# Altium project Tray2.PrjPcb
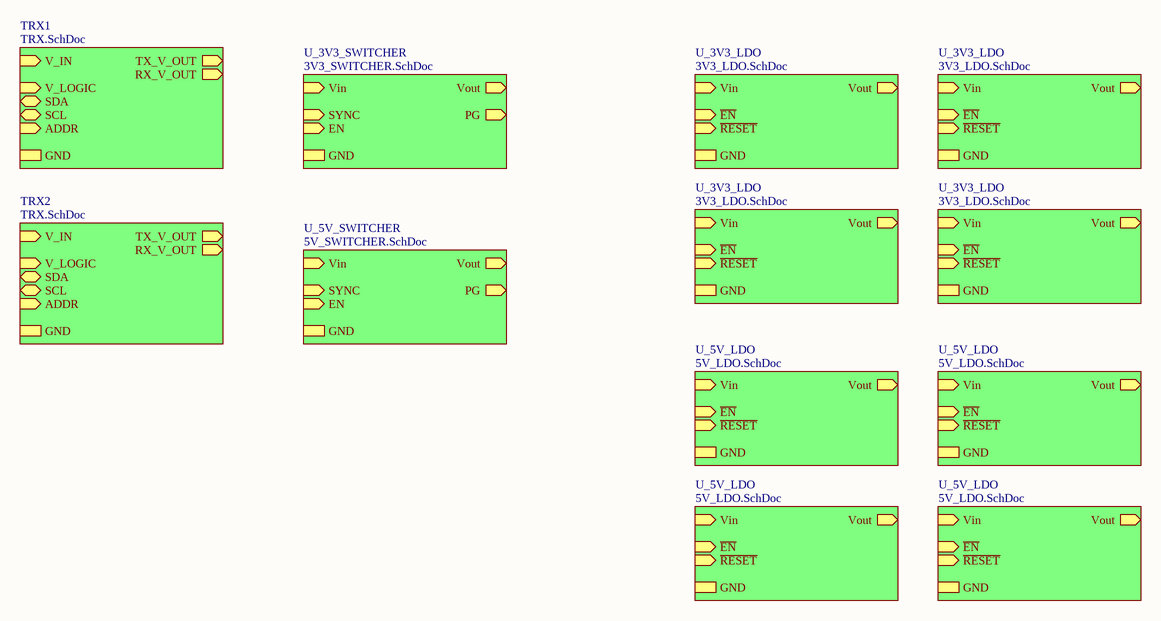
[diagram p0: POWER.SchDoc]
6 sheets, 196 parts. Net scope: hierarchical (ports join the sheet entries above them; power ports are global).
Sheets:
  POWER.SchDoc
    TRX1 = TRX.SchDoc
    TRX2 = TRX.SchDoc
    U_3V3_SWITCHER = 3V3_SWITCHER.SchDoc
    U_5V_SWITCHER = 5V_SWITCHER.SchDoc
    U_3V3_LDO = 3V3_LDO.SchDoc
    U_3V3_LDO = 3V3_LDO.SchDoc
    U_3V3_LDO = 3V3_LDO.SchDoc
    U_3V3_LDO = 3V3_LDO.SchDoc
    U_5V_LDO = 5V_LDO.SchDoc
    U_5V_LDO = 5V_LDO.SchDoc
    U_5V_LDO = 5V_LDO.SchDoc
    U_5V_LDO = 5V_LDO.SchDoc

## Sheet POWER.SchDoc
size A4

### Sub-sheets
TRX1 = TRX.SchDoc: V_IN (in), TX_V_OUT (out), RX_V_OUT (out), V_LOGIC (in), SCL (bidir), SDA (bidir), GND, ADDR (in)
TRX2 = TRX.SchDoc: V_IN (in), TX_V_OUT (out), RX_V_OUT (out), V_LOGIC (in), SCL (bidir), SDA (bidir), GND, ADDR (in)
U_3V3_LDO = 3V3_LDO.SchDoc: Vout (out), ~{EN} (in), ~{RESET} (in), Vin (in), GND
U_3V3_LDO = 3V3_LDO.SchDoc: Vout (out), ~{EN} (in), ~{RESET} (in), Vin (in), GND
U_3V3_LDO = 3V3_LDO.SchDoc: Vout (out), ~{EN} (in), ~{RESET} (in), Vin (in), GND
U_3V3_LDO = 3V3_LDO.SchDoc: Vout (out), ~{EN} (in), ~{RESET} (in), Vin (in), GND
U_3V3_SWITCHER = 3V3_SWITCHER.SchDoc: PG (out), Vout (out), EN (in), Vin (in), SYNC (in), GND
U_5V_LDO = 5V_LDO.SchDoc: Vout (out), ~{EN} (in), ~{RESET} (in), Vin (in), GND
U_5V_LDO = 5V_LDO.SchDoc: Vout (out), ~{EN} (in), ~{RESET} (in), Vin (in), GND
U_5V_LDO = 5V_LDO.SchDoc: Vout (out), ~{EN} (in), ~{RESET} (in), Vin (in), GND
U_5V_LDO = 5V_LDO.SchDoc: Vout (out), ~{EN} (in), ~{RESET} (in), Vin (in), GND
U_5V_SWITCHER = 5V_SWITCHER.SchDoc: PG (out), Vout (out), EN (in), Vin (in), SYNC (in), GND

### Nets
GND: sheet TRX1/GND, sheet TRX2/GND
VCC: sheet TRX1/V_LOGIC, sheet TRX2/V_LOGIC

## Sheet TRX.SchDoc: Title Block Template
size A3; Engineer: C. BROWN; Organization: BLUEsat Project; Address1: Room 419; Address2: School of EE&T; Address3: UNSW, NSW 2052; Address4: Australia; DocumentNumber: TITL0002; SheetNumber: 1; SheetTotal: 1; Description: Sample Title Block; Version: 2.0
Used 2 times, as channels TRX1, TRX2. Parts and nets are listed once, with the designators drawn on the sheet.
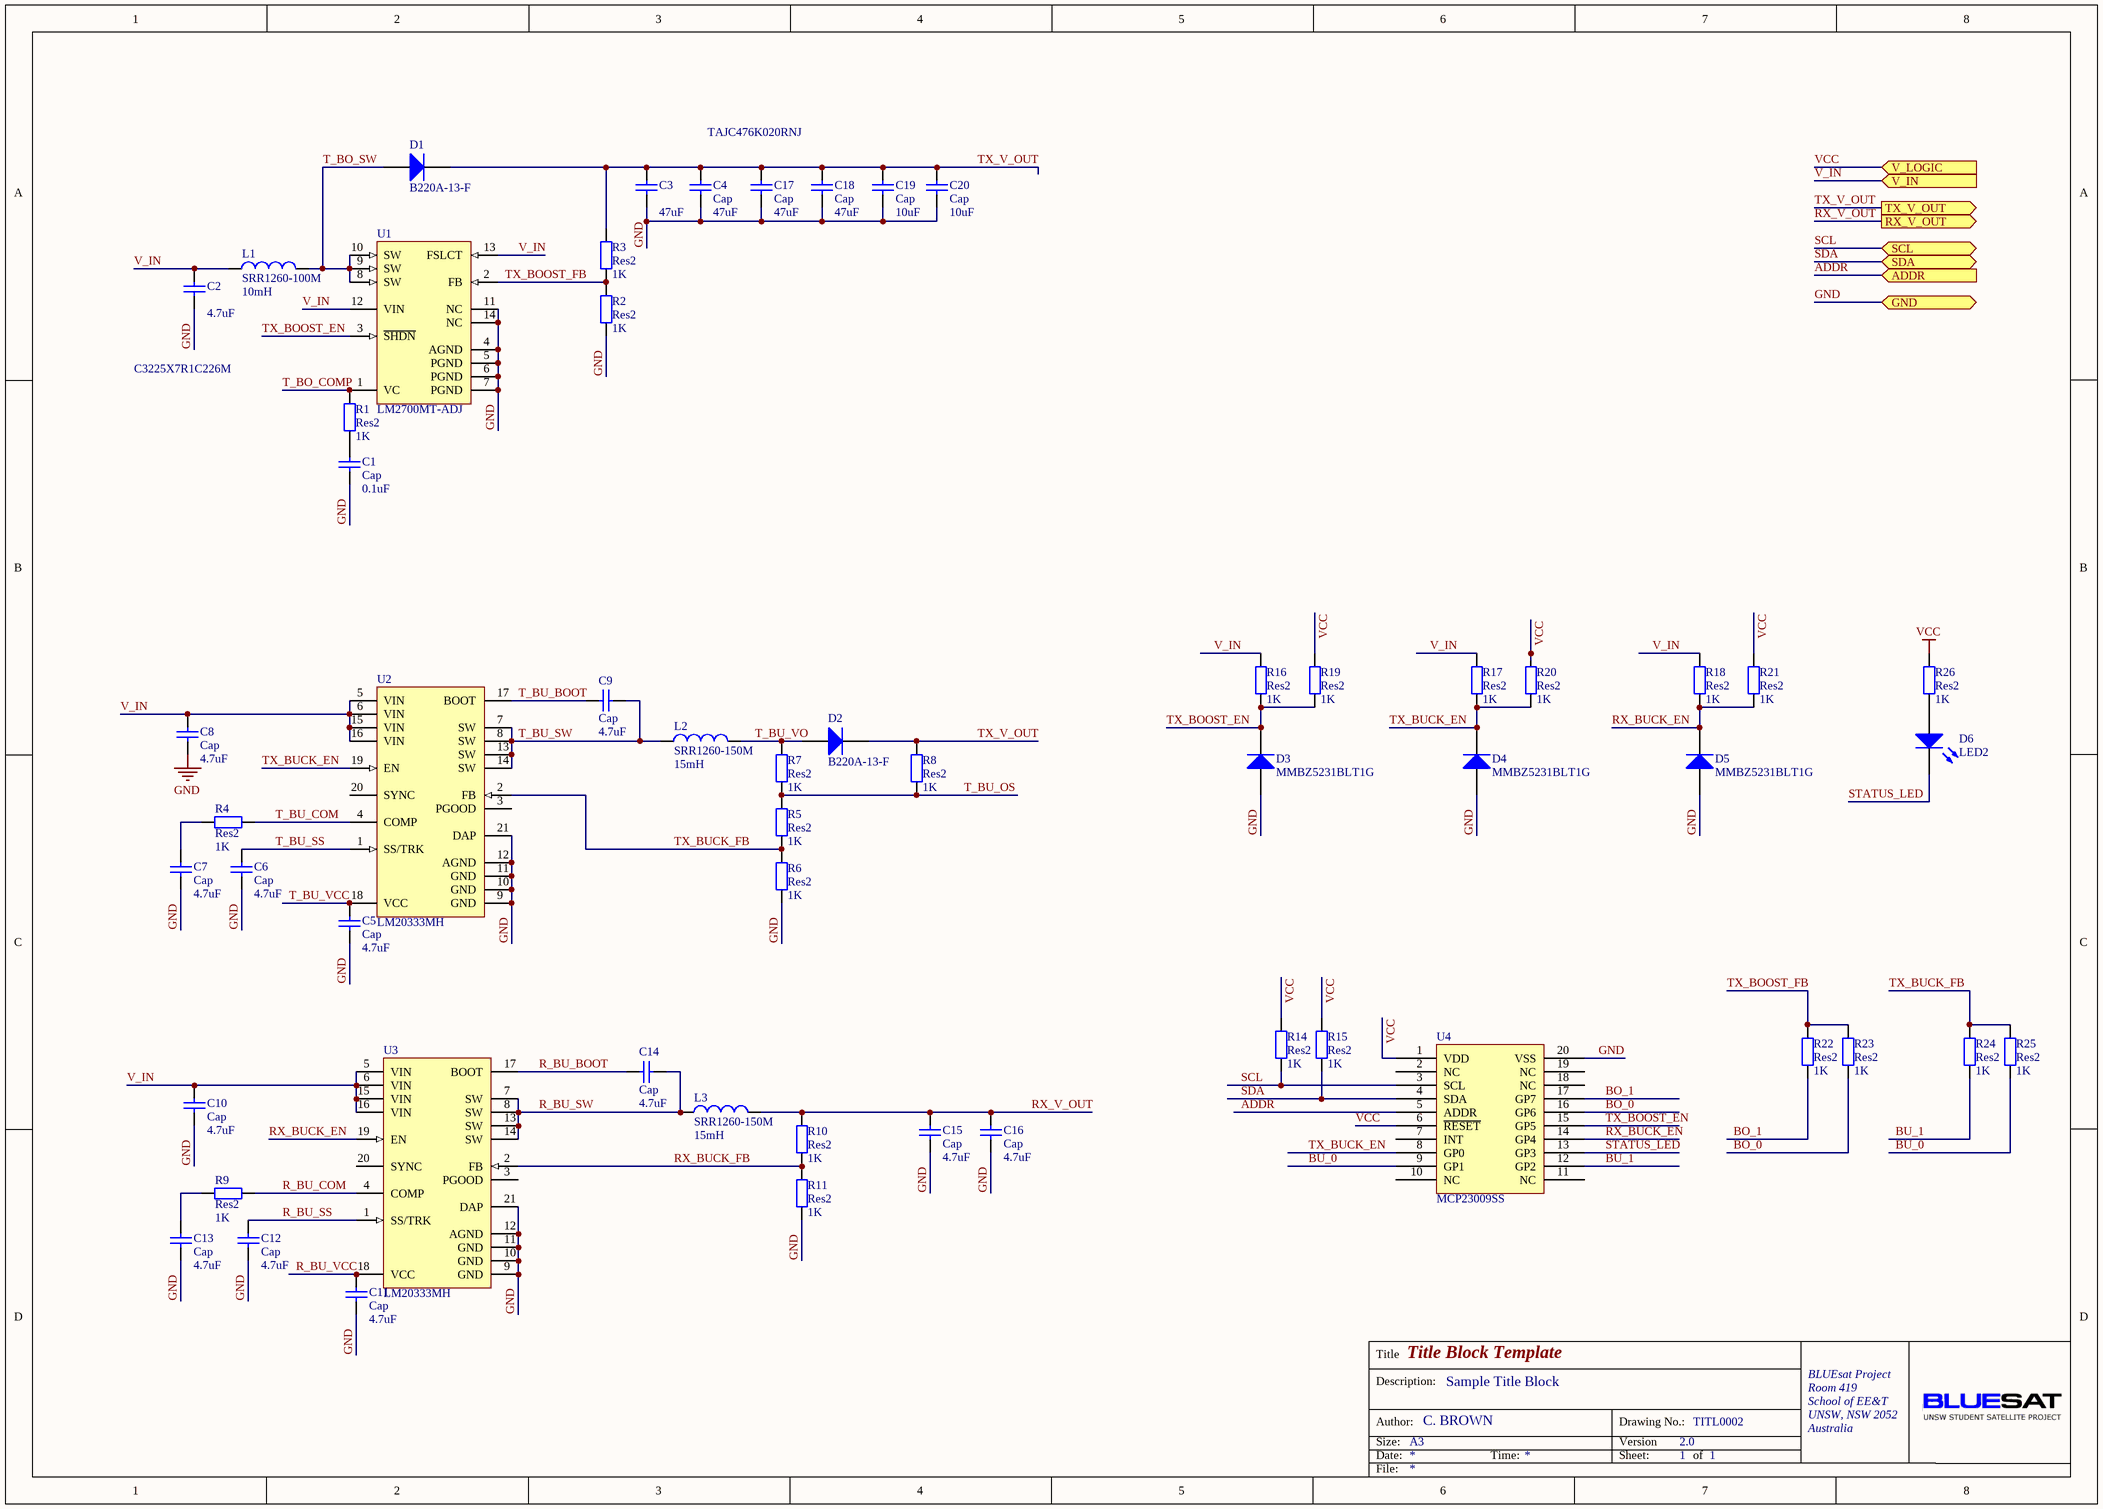
[diagram p1: TRX.SchDoc]

### Parts
C1  Cap  value 0.1uF  [R0805M]
C2  C3225X7R1C226M  value 4.7uF  [R1210M]
C3  TAJC476K020RNJ  value 47uF  [TANTCASEC]
C4  Cap  value 47uF  [TANTCASEC]
C5  Cap  value 4.7uF  [R0805M]
C6  Cap  value 4.7uF  [R0805M]
C7  Cap  value 4.7uF  [R0805M]
C8  Cap  value 4.7uF  [R1210M]
C9  Cap  value 4.7uF  [R0805M]
C10  Cap  value 4.7uF  [R1210M]
C11  Cap  value 4.7uF  [R0805M]
C12  Cap  value 4.7uF  [R0805M]
C13  Cap  value 4.7uF  [R0805M]
C14  Cap  value 4.7uF  [R0805M]
C15  Cap  value 4.7uF  [R0805M]
C16  Cap  value 4.7uF  [R0805M]
C17  Cap  value 47uF  [TANTCASEC]
C18  Cap  value 47uF  [TANTCASEC]
C19  Cap  value 10uF  [R0805M]
C20  Cap  value 10uF  [R0805M]
D1  B220A-13-F  [DIODESMA]
D2  B220A-13-F  [DIODESMA]
D3  MMBZ5231BLT1G  [SOT95P240-3N]
D4  MMBZ5231BLT1G  [SOT95P240-3N]
D5  MMBZ5231BLT1G  [SOT95P240-3N]
D6  LED2  [R0805M]
L1  SRR1260-100M  value 10mH  [SRR1260M]
L2  SRR1260-150M  value 15mH  [SRR1260M]
L3  SRR1260-150M  value 15mH  [SRR1260M]
R1  Res2  value 1K  [R0805M]
R2  Res2  value 1K  [R0805M]
R3  Res2  value 1K  [R0805M]
R4  Res2  value 1K  [R0805M]
R5  Res2  value 1K  [R0805M]
R6  Res2  value 1K  [R0805M]
R7  Res2  value 1K  [R0805M]
R8  Res2  value 1K  [R0805M]
R9  Res2  value 1K  [R0805M]
R10  Res2  value 1K  [R0805M]
R11  Res2  value 1K  [R0805M]
R14  Res2  value 1K  [R0805M]
R15  Res2  value 1K  [R0805M]
R16  Res2  value 1K  [R0805M]
R17  Res2  value 1K  [R0805M]
R18  Res2  value 1K  [R0805M]
R19  Res2  value 1K  [R0805M]
R20  Res2  value 1K  [R0805M]
R21  Res2  value 1K  [R0805M]
R22  Res2  value 1K  [R0805M]
R23  Res2  value 1K  [R0805M]
R24  Res2  value 1K  [R0805M]
R25  Res2  value 1K  [R0805M]
R26  Res2  value 1K  [R0805M]
U1  LM2700MT-ADJ  [MTC14_N]
U2  LM20333MH  [MXA20A_N]
U3  LM20333MH  [MXA20A_N]
U4  MCP23009SS  [SSOP-SS20_M]

### Ports
ADDR (in), GND, RX_V_OUT (out), SCL (bidir), SDA (bidir), TX_V_OUT (out), V_IN (in), V_LOGIC (in)

### Nets
GND: C1.1 C2.1 C3.1 C4.1 C5.1 C6.1 C7.1 C8.1 C10.1 C11.1 C12.1 C13.1 C15.1 C16.1 C17.1 C18.1 C19.1 C20.1 D3.1(A) D4.1(A) D5.1(A) R2.1 R6.2 R11.1 U1.4(AGND) U1.5(PGND) U1.6(PGND) U1.7(PGND) U1.11(NC) U1.14(NC) U2.9(GND) U2.10(GND) U2.11(GND) U2.12(AGND) U2.21(DAP) U3.9(GND) U3.10(GND) U3.11(GND) U3.12(AGND) U3.21(DAP) U4.20(VSS) ; port GND
VCC: R14.2 R15.2 R19.2 R20.2 R21.2 R26.2 U4.1(VDD) U4.6(~{RESET}) ; port V_LOGIC
ADDR: U4.5(ADDR) ; port ADDR
BO_0: R23.1 U4.16(GP6)
BO_1: R22.1 U4.17(GP7)
BU_0: R25.1 U4.9(GP1)
BU_1: R24.1 U4.12(GP2)
R_BU_BOOT: C14.1 U3.17(BOOT)
R_BU_COM: R9.1 U3.4(COMP)
R_BU_SS: C12.2 U3.1(SS/TRK)
R_BU_SW: C14.2 L3.1 U3.7(SW) U3.8(SW) U3.13(SW) U3.14(SW)
R_BU_VCC: C11.2 U3.18(VCC)
RX_BUCK_EN: D5.3(K) R18.1 R21.1 U3.19(EN) U4.14(GP4)
RX_BUCK_FB: R10.1 R11.2 U3.2(FB)
RX_V_OUT: C15.2 C16.2 L3.2 R10.2 ; port RX_V_OUT
SCL: R14.1 U4.3(SCL) ; port SCL
SDA: R15.1 U4.4(SDA) ; port SDA
STATUS_LED: D6.2(K) U4.13(GP3)
T_BO_COMP: R1.2 U1.1(VC)
T_BO_SW: D1.1(A) L1.2 U1.8(SW) U1.9(SW) U1.10(SW)
T_BU_BOOT: C9.2 U2.17(BOOT)
T_BU_COM: R4.1 U2.4(COMP)
T_BU_OS: R5.1 R7.2 R8.2
T_BU_SS: C6.2 U2.1(SS/TRK)
T_BU_SW: C9.1 L2.1 U2.7(SW) U2.8(SW) U2.13(SW) U2.14(SW)
T_BU_VCC: C5.2 U2.18(VCC)
T_BU_VO: D2.1(A) L2.2 R7.1
TX_BOOST_EN: D3.3(K) R16.1 R19.1 U1.3(~{SHDN}) U4.15(GP5)
TX_BOOST_FB: R2.2 R3.1 R22.2 R23.2 U1.2(FB)
TX_BUCK_EN: D4.3(K) R17.1 R20.1 U2.19(EN) U4.8(GP0)
TX_BUCK_FB: R5.2 R6.1 R24.2 R25.2 U2.2(FB)
TX_V_OUT: C3.2 C4.2 C17.2 C18.2 C19.2 C20.2 D1.2(K) D2.2(K) R3.2 R8.1 ; port TX_V_OUT
V_IN: C2.2 C8.2 C10.2 L1.1 R16.2 R17.2 R18.2 U1.12(VIN) U1.13(FSLCT) U2.5(VIN) U2.6(VIN) U2.15(VIN) U2.16(VIN) U3.5(VIN) U3.6(VIN) U3.15(VIN) U3.16(VIN) ; port V_IN
NetC1_2: C1.2 R1.1
NetC7_2: C7.2 R4.2
NetC13_2: C13.2 R9.2
NetD6_1: D6.1(A) R26.1

Not connected (* = marked no-connect by the designer): U2 3(PGOOD) 20(SYNC); U3 3(PGOOD) 20(SYNC); U4 2(NC) 7(INT) 10(NC) 11(NC) 18(NC) 19(NC)

### Channels
TRX1: designators end in _TRX1; ports ADDR=ADDR_TRX1 GND=GND RX_V_OUT=RX_V_OUT_TRX1 SCL=SCL_TRX1 SDA=SDA_TRX1 TX_V_OUT=TX_V_OUT_TRX1 V_IN=V_IN_TRX1 V_LOGIC=VCC
TRX2: designators end in _TRX2; ports ADDR=ADDR_TRX2 GND=GND RX_V_OUT=RX_V_OUT_TRX2 SCL=SCL_TRX2 SDA=SDA_TRX2 TX_V_OUT=TX_V_OUT_TRX2 V_IN=V_IN_TRX2 V_LOGIC=VCC

### Notes on the sheet
- Title
- Description:
- Size:
- Author:
- Date:
- A3
- Time:
- Version
- Sheet:
- Drawing No.:
- of
- File:

### Library data of the parts
C1-C20 = Cap: Capacitor; Published: 8-Jun-2000; LatestRevisionDate: 17-Jul-2002; LatestRevisionNote: Re-released for DXP Platform.; PackageReference: RAD-0.3; Publisher: Altium Limited
D1 D2 = Diode 1N4148: High Conductance Fast Diode; Published: 8-Jun-2000; LatestRevisionDate: 17-Jul-2002; LatestRevisionNote: Re-released for DXP Platform.; DatasheetVersion: 1997; PackageReference: DO-35; Publisher: Altium Limited; Code_JEDEC: DO-204-AH; ComponentLink1Description: Manufacturer Link; ComponentLink1URL: http://www.fairchildsemi.com/; ComponentLink2Description: Datasheet; ComponentLink2URL: http://www.fairchildsemi.com/ds/1N%2F1N4148.pdf
D3-D5 = Diode BAS16: Silicon Switching Diode for High-Speed Switching; Note: Pin 2 is not connected and not drawn.; Published: 21-Mar-2003; LatestRevisionDate: 29-May-2009; LatestRevisionNote: IPC-7351 Footprint Added.; DatasheetVersion: Oct-1999; PackageVersion: Sep-2001; PackageReference: SOT-23; Publisher: Altium Limited; PackageDescription: 3-Pin SOT-23 Package 0.95 mm Pitch, 2.5 mm Lead Span; ComponentLink1Description: Manufacturer Link; ComponentLink1URL: http://www.infineon.com/; ComponentLink2Description: Datasheet; ComponentLink2URL: http://www.infineon.com/upload/Document/cmc_upload/documents/012/5331/bas16series.pdf
D6 = LED2: Typical RED, GREEN, YELLOW, AMBER GaAs LED; Published: 8-Jun-2000; LatestRevisionDate: 17-Jul-2002; LatestRevisionNote: Re-released for DXP Platform.; PackageVersion: Feb-2002; PackageReference: 3.2X1.6X1.1; Publisher: Altium Limited
L1-L3 = Inductor: Code_IEC: 1005; Published: 8-Jun-2000; LatestRevisionDate: 29-May-2009; LatestRevisionNote: IPC-7351 Footprint Added.; PackageReference: 0402-A; Publisher: Altium Limited; PackageDescription: Chip Inductor; Code_JEITA: 0402
R1-R11 R14-R26 = Res2: Resistor; Published: 8-Jun-2000; LatestRevisionDate: 17-Jul-2002; LatestRevisionNote: Re-released for DXP Platform.; PackageReference: AXIAL-0.4; Publisher: Altium Limited
U1 = LM2700MT-ADJ: 600kHz/1.25MHz, 2.5A, Step-up PWM DC/DC Converter; Manufacturer: National Semiconductor; CompType: Switcher; PackageTopMarking: NSZXYTT*2700MT*-ADJ; PowerWise: N; Published: 4-Dec-2008; DatasheetVersion: May-2004; PackageVersion: revD, Jun-2003; PackageReference: MTC14; Publisher: Altium Limited; PackageDescription: Molded TSSOP, JEDEC, 5 x 4.4 x 0.9mm Body, 14 Lead, 0.65mm Pitch; PartNumber: LM2700MT-ADJ; RoHS: O; PinCount: 14; DigiKeyPartNumber: LM2700MT-ADJ-ND; Code_JEDEC: MO-153-AB-1; ComponentLink1Description: LM2700 Datasheet; ComponentLink1URL: http://www.national.com/ds/LM/LM2700.pdf; ComponentLink2Description: LM2700 Web Page; ComponentLink2URL: http://www.national.com/pf/LM/LM2700.html; ComponentLink3Description: MTC14 Package Drawing; ComponentLink3URL: http://www.national.com/packaging/folders/mtc14.html
U2 U3 = LM20333MH: 36V, 3A PowerWise Synchronous Buck Regulator with Frequency Synchronization; Manufacturer: National Semiconductor; CompType: Switcher; PackageTopMarking: NSUZXYTT*20333MH; Published: 4-Dec-2008; DatasheetVersion: Jun-2008; PackageVersion: revC, Jul-2006; PackageReference: MXA20A; Publisher: Altium Limited; PackageDescription: Molded TSSOP, Jedec, 6.5 x 4.4 x 0.9mm Body, 20 Lead, 0.65mm Pitch, Exposed Pad; PartNumber: LM20333MH; RoHS: Y; PinCount: 20; DigiKeyPartNumber: LM20333MH-ND; Code_JEDEC: MO-153-ACT; ComponentLink1Description: LM20333 Datasheet; ComponentLink1URL: http://www.national.com/ds/LM/LM20333.pdf; ComponentLink2Description: LM20333 Web Page; ComponentLink2URL: http://www.national.com/pf/LM/LM20333.html; ComponentLink3Description: MXA20A Package Drawing; ComponentLink3URL: http://www.national.com/packaging/folders/mxa20a.html

## Sheet 3V3_SWITCHER.SchDoc
size A3; Description: Sample Title Block; Version: 1.0
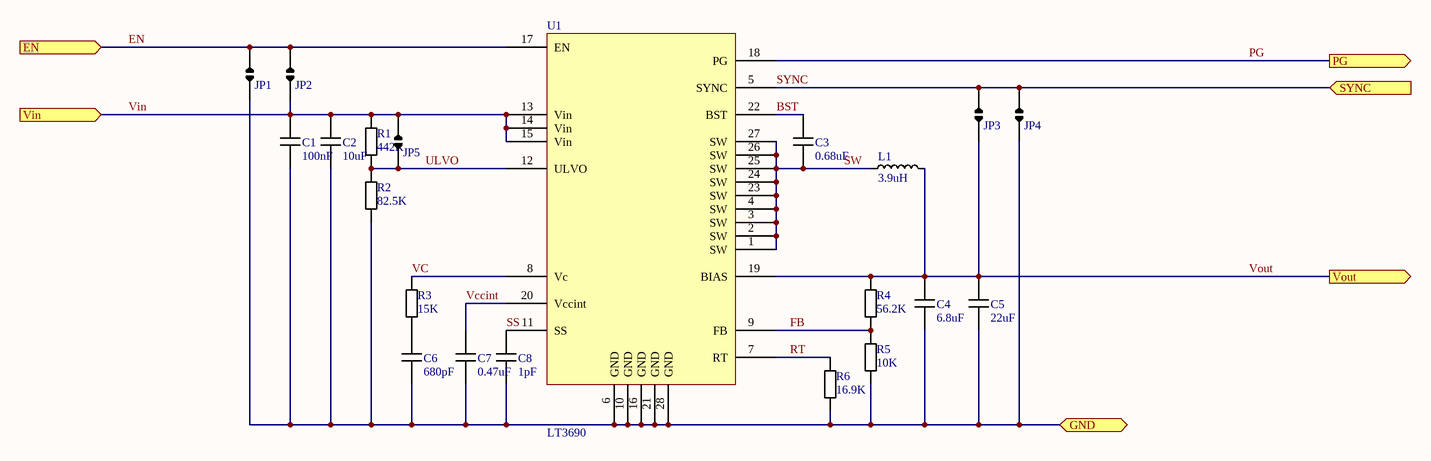
[diagram p2: 3V3_SWITCHER.SchDoc]

### Parts
(Parts that share a designator on the sheet are numbered #1, #2 ... from top to bottom, then left to right.)
C1#1  value 100nF  [0805 Cap]  (hidden comment: 0805 Cap)
C2#1  value 10uF  [1206 Cap]  (hidden comment: 1206 Cap)
C3#1  value 0.68uF  [0805 Cap]  (hidden comment: 0805 Cap)
C4#1  value 6.8uF  [0805 Cap]  (hidden comment: 0805 Cap)
C5#1  value 22uF  [1206 Cap]  (hidden comment: 1206 Cap)
C6#1  value 680pF  [0805 Cap]  (hidden comment: 0805 Cap)
C7#1  value 0.47uF  [0805 Cap]  (hidden comment: 0805 Cap)
C8#1  value 1pF  [0805 Cap]  (hidden comment: 0805 Cap)
JP1#1  Jumper  [Solder Jumper C]  (value not drawn)
JP2#1  Jumper  [Solder Jumper C]  (value not drawn)
JP3#1  Jumper  [Solder Jumper C]  (value not drawn)
JP4#1  Jumper  [Solder Jumper C]  (value not drawn)
JP5#1  Jumper  [Solder Jumper C]  (value not drawn)
L1#1  value 3.9uH  [INDP4037X16N]  (hidden comment: LQH44PN2R2MP0)
R1#1  value 442K  [0805 Resistor]  (hidden comment: 0805 Resistor)
R2#1  value 82.5K  [0805 Resistor]  (hidden comment: 0805 Resistor)
R3#1  value 15K  [0805 Resistor]  (hidden comment: 0805 Resistor)
R4#1  value 56.2K  [0805 Resistor]  (hidden comment: 0805 Resistor)
R5#1  value 10K  [0805 Resistor]  (hidden comment: 0805 Resistor)
R6#1  value 16.9K  [0805 Resistor]  (hidden comment: 0805 Resistor)
U1#1  LT3690  [LT3690]

### Ports
EN (in), GND, PG (out), SYNC (in), Vin (in), Vout (out)

### Nets
BST: C3#1.2 U1#1.22(BST)
EN: JP1#1.1 JP2#1.1 U1#1.17(EN) ; port EN
FB: R4#1.1 R5#1.2 U1#1.9(FB)
PG: U1#1.18(PG) ; port PG
RT: R6#1.2 U1#1.7(RT)
SS: C8#1.2 U1#1.11(SS)
SW: C3#1.1 L1#1.1 U1#1.1(SW) U1#1.2(SW) U1#1.3(SW) U1#1.4(SW) U1#1.23(SW) U1#1.24(SW) U1#1.25(SW) U1#1.26(SW) U1#1.27(SW)
SYNC: JP3#1.1 JP4#1.1 U1#1.5(SYNC) ; port SYNC
ULVO: JP5#1.2 R1#1.1 R2#1.2 U1#1.12(ULVO)
VC: R3#1.2 U1#1.8(Vc)
Vccint: C7#1.2 U1#1.20(Vccint)
Vin: C1#1.2 C2#1.2 JP2#1.2 JP5#1.1 R1#1.2 U1#1.13(Vin) U1#1.14(Vin) U1#1.15(Vin) ; port Vin
Vout: C4#1.2 C5#1.2 JP3#1.2 L1#1.2 R4#1.2 U1#1.19(BIAS) ; port Vout
NetC1#1_1: C1#1.1 C2#1.1 C4#1.1 C5#1.1 C6#1.1 C7#1.1 C8#1.1 JP1#1.2 JP4#1.2 R2#1.1 R5#1.1 R6#1.1 U1#1.6(GND) U1#1.10(GND) U1#1.16(GND) U1#1.21(GND) U1#1.28(GND) ; port GND
NetC6#1_2: C6#1.2 R3#1.1

### Notes on the sheet
- Title
- Description:
- Size:
- Author:
- Date:
- A3
- Time:
- Version
- Sheet:
- Drawing No.:
- of
- File:

### Library data of the parts
C1#1 C3#1 C4#1 C7#1 = 0805 MLCC - X7R, 10%
C2#1 C5#1 = 1206 MLCC - X7R, 10%
C6#1 C8#1 = 0805 MLCC - NP0, 5%
JP1#1 JP2#1 JP3#1 JP4#1 JP5#1 = Solder Bridge
L1#1 = LQH44PN2R2MP0: Inductor 4x4mm 2.2uH; ComponentLink1Description: Datasheet; ComponentLink1URL: http://search.murata.co.jp/Ceramy/image/img/PDF/ENG/L0075S0103LQH44P.pdf
R1#1 R2#1 R3#1 R4#1 R5#1 R6#1 = 0805 Thick Film Resistor 1%

## Sheet 5V_SWITCHER.SchDoc
size A3; Description: Sample Title Block; Version: 1.0
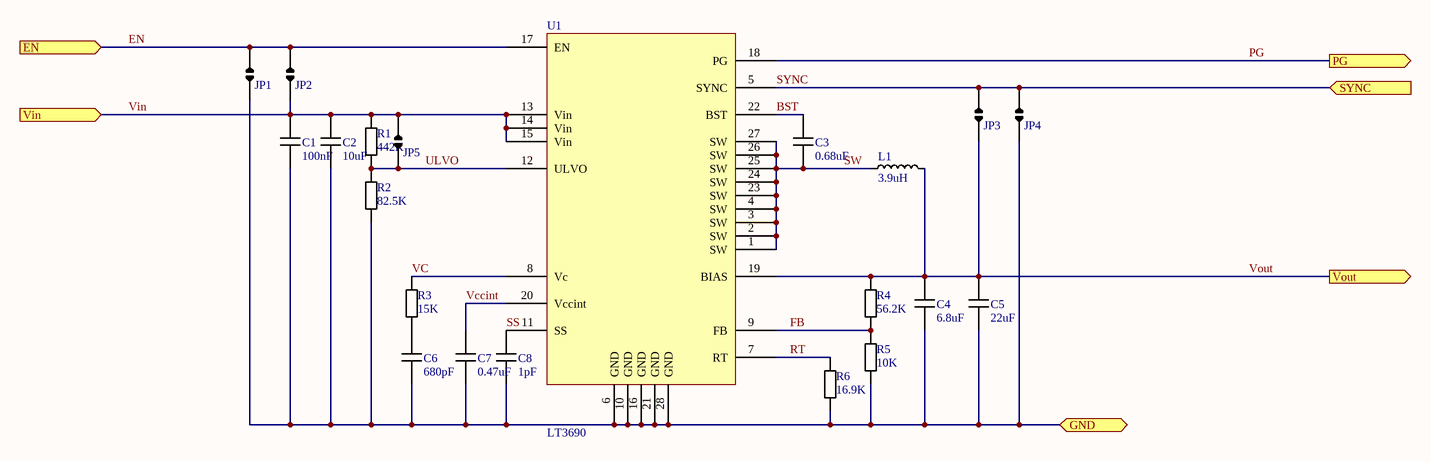
[diagram p3: 5V_SWITCHER.SchDoc]

### Parts
(Parts that share a designator on the sheet are numbered #1, #2 ... from top to bottom, then left to right.)
C1#2  value 100nF  [0805 Cap]  (hidden comment: 0805 Cap)
C2#2  value 10uF  [1206 Cap]  (hidden comment: 1206 Cap)
C3#2  value 0.68uF  [0805 Cap]  (hidden comment: 0805 Cap)
C4#2  value 6.8uF  [0805 Cap]  (hidden comment: 0805 Cap)
C5#2  value 22uF  [1206 Cap]  (hidden comment: 1206 Cap)
C6#2  value 680pF  [0805 Cap]  (hidden comment: 0805 Cap)
C7#2  value 0.47uF  [0805 Cap]  (hidden comment: 0805 Cap)
C8#2  value 1pF  [0805 Cap]  (hidden comment: 0805 Cap)
JP1#2  Jumper  [Solder Jumper C]  (value not drawn)
JP2#2  Jumper  [Solder Jumper C]  (value not drawn)
JP3#2  Jumper  [Solder Jumper C]  (value not drawn)
JP4#2  Jumper  [Solder Jumper C]  (value not drawn)
JP5#2  Jumper  [Solder Jumper C]  (value not drawn)
L1#2  value 3.9uH  [INDP4037X16N]  (hidden comment: LQH44PN2R2MP0)
R1#2  value 442K  [0805 Resistor]  (hidden comment: 0805 Resistor)
R2#2  value 82.5K  [0805 Resistor]  (hidden comment: 0805 Resistor)
R3#2  value 15K  [0805 Resistor]  (hidden comment: 0805 Resistor)
R4#2  value 56.2K  [0805 Resistor]  (hidden comment: 0805 Resistor)
R5#2  value 10K  [0805 Resistor]  (hidden comment: 0805 Resistor)
R6#2  value 16.9K  [0805 Resistor]  (hidden comment: 0805 Resistor)
U1#2  LT3690  [LT3690]

### Ports
EN (in), GND, PG (out), SYNC (in), Vin (in), Vout (out)

### Nets
BST: C3#2.2 U1#2.22(BST)
EN: JP1#2.1 JP2#2.1 U1#2.17(EN) ; port EN
FB: R4#2.1 R5#2.2 U1#2.9(FB)
PG: U1#2.18(PG) ; port PG
RT: R6#2.2 U1#2.7(RT)
SS: C8#2.2 U1#2.11(SS)
SW: C3#2.1 L1#2.1 U1#2.1(SW) U1#2.2(SW) U1#2.3(SW) U1#2.4(SW) U1#2.23(SW) U1#2.24(SW) U1#2.25(SW) U1#2.26(SW) U1#2.27(SW)
SYNC: JP3#2.1 JP4#2.1 U1#2.5(SYNC) ; port SYNC
ULVO: JP5#2.2 R1#2.1 R2#2.2 U1#2.12(ULVO)
VC: R3#2.2 U1#2.8(Vc)
Vccint: C7#2.2 U1#2.20(Vccint)
Vin: C1#2.2 C2#2.2 JP2#2.2 JP5#2.1 R1#2.2 U1#2.13(Vin) U1#2.14(Vin) U1#2.15(Vin) ; port Vin
Vout: C4#2.2 C5#2.2 JP3#2.2 L1#2.2 R4#2.2 U1#2.19(BIAS) ; port Vout
NetC1#2_1: C1#2.1 C2#2.1 C4#2.1 C5#2.1 C6#2.1 C7#2.1 C8#2.1 JP1#2.2 JP4#2.2 R2#2.1 R5#2.1 R6#2.1 U1#2.6(GND) U1#2.10(GND) U1#2.16(GND) U1#2.21(GND) U1#2.28(GND) ; port GND
NetC6#2_2: C6#2.2 R3#2.1

### Notes on the sheet
- Title
- Description:
- Size:
- Author:
- Date:
- A3
- Time:
- Version
- Sheet:
- Drawing No.:
- of
- File:

### Library data of the parts
C1#2 C3#2 C4#2 C7#2 = 0805 MLCC - X7R, 10%
C2#2 C5#2 = 1206 MLCC - X7R, 10%
C6#2 C8#2 = 0805 MLCC - NP0, 5%
JP1#2 JP2#2 JP3#2 JP4#2 JP5#2 = Solder Bridge
L1#2 = LQH44PN2R2MP0: Inductor 4x4mm 2.2uH; ComponentLink1Description: Datasheet; ComponentLink1URL: http://search.murata.co.jp/Ceramy/image/img/PDF/ENG/L0075S0103LQH44P.pdf
R1#2 R2#2 R3#2 R4#2 R5#2 R6#2 = 0805 Thick Film Resistor 1%

## Sheet 3V3_LDO.SchDoc
size A3; Description: Sample Title Block; Version: 1.0
Used 4 times, as channels U_3V3_LDO, U_3V3_LDO, U_3V3_LDO, U_3V3_LDO. Parts and nets are listed once, with the designators drawn on the sheet.
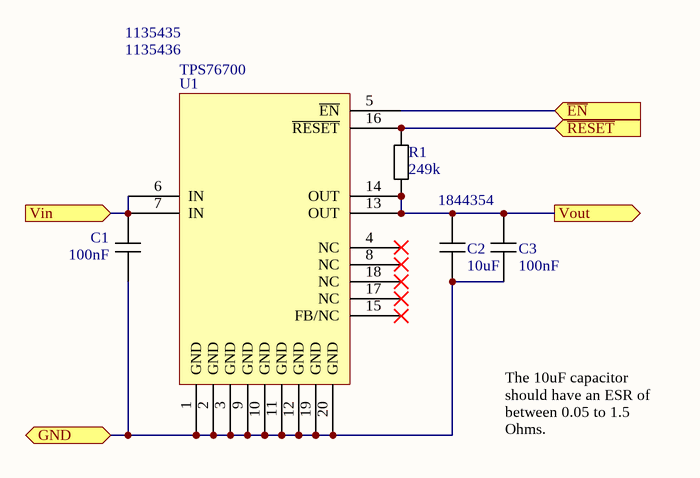
[diagram p4: 3V3_LDO.SchDoc]

### Parts
C1  value 100nF  [0805 Cap]  (hidden comment: 0805 Cap)
C2  value 10uF  Supplier Part Number 1: 1844354  [1210 Cap]  (hidden comment: 1210 Cap)
C3  value 100nF  [0805 Cap]  (hidden comment: 0805 Cap)
R1  value 249k  [0805 Resistor]  (hidden comment: 0805 Resistor)
U1  TPS76700  Supplier Part Number 1: 1135436  Supplier Part Number 2: 1135435  [SOP-20 TPS76700]

### Ports
GND, Vin (in), Vout (out), ~{EN} (in), ~{RESET} (in)

### Nets
~{EN}: U1.5(~{EN}) ; port ~{EN}
GND: C1.1 C2.1 C3.1 U1.1(GND) U1.2(GND) U1.3(GND) U1.9(GND) U1.10(GND) U1.11(GND) U1.12(GND) U1.19(GND) U1.20(GND) ; port GND
~{RESET}: R1.2 U1.16(~{RESET}) ; port ~{RESET}
Vin: C1.2 U1.6(IN) U1.7(IN) ; port Vin
Vout: C2.2 C3.2 R1.1 U1.13(OUT) U1.14(OUT) ; port Vout

Not connected (* = marked no-connect by the designer): U1 4(NC)* 8(NC)* 15(FB/NC)* 17(NC)* 18(NC)*

### Channels
U_3V3_LDO: designators end in _U_3V3_LDO#1; ports GND=NetC1_U_3V3_LDO#1_1 Vin=NetC1_U_3V3_LDO#1_2 Vout=NetC2_U_3V3_LDO#1_2 ~{EN}=NetU1_U_3V3_LDO#1_5 ~{RESET}=NetR1_U_3V3_LDO#1_2
U_3V3_LDO: designators end in _U_3V3_LDO#2; ports GND=NetC1_U_3V3_LDO#2_1 Vin=NetC1_U_3V3_LDO#2_2 Vout=NetC2_U_3V3_LDO#2_2 ~{EN}=NetU1_U_3V3_LDO#2_5 ~{RESET}=NetR1_U_3V3_LDO#2_2
U_3V3_LDO: designators end in _U_3V3_LDO#3; ports GND=NetC1_U_3V3_LDO#3_1 Vin=NetC1_U_3V3_LDO#3_2 Vout=NetC2_U_3V3_LDO#3_2 ~{EN}=NetU1_U_3V3_LDO#3_5 ~{RESET}=NetR1_U_3V3_LDO#3_2
U_3V3_LDO: designators end in _U_3V3_LDO#4; ports GND=NetC1_U_3V3_LDO#4_1 Vin=NetC1_U_3V3_LDO#4_2 Vout=NetC2_U_3V3_LDO#4_2 ~{EN}=NetU1_U_3V3_LDO#4_5 ~{RESET}=NetR1_U_3V3_LDO#4_2

### Notes on the sheet
- The 10uF capacitor should have an ESR of between 0.05 to 1.5 Ohms.
- Title
- Description:
- Size:
- Author:
- Date:
- A3
- Time:
- Version
- Sheet:
- Drawing No.:
- of
- File:

### Library data of the parts
C1 C3 = 0805 MLCC - X7R, 10%
C2 = 1210 MLCC - X7R, 10%: Supplier 1: Farnell
R1 = 0805 Thick Film Resistor 1%
U1 = TPS76700: LDO Regulator - ER; Supplier 1: Farnell; Supplier 2: Farnell

## Sheet 5V_LDO.SchDoc
size A3; Description: Sample Title Block; Version: 1.0
Used 4 times, as channels U_5V_LDO, U_5V_LDO, U_5V_LDO, U_5V_LDO. Parts and nets are listed once, with the designators drawn on the sheet.
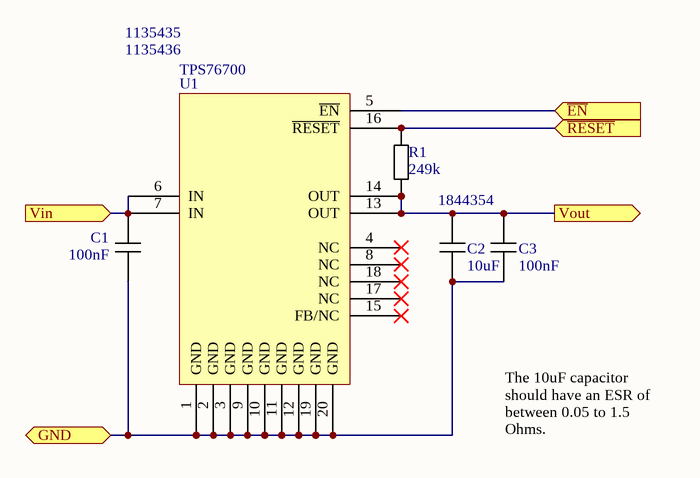
[diagram p5: 5V_LDO.SchDoc]

### Parts
C1  value 100nF  [0805 Cap]  (hidden comment: 0805 Cap)
C2  value 10uF  Supplier Part Number 1: 1844354  [1210 Cap]  (hidden comment: 1210 Cap)
C3  value 100nF  [0805 Cap]  (hidden comment: 0805 Cap)
R1  value 249k  [0805 Resistor]  (hidden comment: 0805 Resistor)
U1  TPS76700  Supplier Part Number 1: 1135436  Supplier Part Number 2: 1135435  [SOP-20 TPS76700]

### Ports
GND, Vin (in), Vout (out), ~{EN} (in), ~{RESET} (in)

### Nets
~{EN}: U1.5(~{EN}) ; port ~{EN}
GND: C1.1 C2.1 C3.1 U1.1(GND) U1.2(GND) U1.3(GND) U1.9(GND) U1.10(GND) U1.11(GND) U1.12(GND) U1.19(GND) U1.20(GND) ; port GND
~{RESET}: R1.2 U1.16(~{RESET}) ; port ~{RESET}
Vin: C1.2 U1.6(IN) U1.7(IN) ; port Vin
Vout: C2.2 C3.2 R1.1 U1.13(OUT) U1.14(OUT) ; port Vout

Not connected (* = marked no-connect by the designer): U1 4(NC)* 8(NC)* 15(FB/NC)* 17(NC)* 18(NC)*

### Channels
U_5V_LDO: designators end in _U_5V_LDO#1; ports GND=NetC1_U_5V_LDO#1_1 Vin=NetC1_U_5V_LDO#1_2 Vout=NetC2_U_5V_LDO#1_2 ~{EN}=NetU1_U_5V_LDO#1_5 ~{RESET}=NetR1_U_5V_LDO#1_2
U_5V_LDO: designators end in _U_5V_LDO#2; ports GND=NetC1_U_5V_LDO#2_1 Vin=NetC1_U_5V_LDO#2_2 Vout=NetC2_U_5V_LDO#2_2 ~{EN}=NetU1_U_5V_LDO#2_5 ~{RESET}=NetR1_U_5V_LDO#2_2
U_5V_LDO: designators end in _U_5V_LDO#3; ports GND=NetC1_U_5V_LDO#3_1 Vin=NetC1_U_5V_LDO#3_2 Vout=NetC2_U_5V_LDO#3_2 ~{EN}=NetU1_U_5V_LDO#3_5 ~{RESET}=NetR1_U_5V_LDO#3_2
U_5V_LDO: designators end in _U_5V_LDO#4; ports GND=NetC1_U_5V_LDO#4_1 Vin=NetC1_U_5V_LDO#4_2 Vout=NetC2_U_5V_LDO#4_2 ~{EN}=NetU1_U_5V_LDO#4_5 ~{RESET}=NetR1_U_5V_LDO#4_2

### Notes on the sheet
- The 10uF capacitor should have an ESR of between 0.05 to 1.5 Ohms.
- Title
- Description:
- Size:
- Author:
- Date:
- A3
- Time:
- Version
- Sheet:
- Drawing No.:
- of
- File:

### Library data of the parts
C1 C3 = 0805 MLCC - X7R, 10%
C2 = 1210 MLCC - X7R, 10%: Supplier 1: Farnell
R1 = 0805 Thick Film Resistor 1%
U1 = TPS76700: LDO Regulator - ER; Supplier 1: Farnell; Supplier 2: Farnell

## Nets that join several sheets
GND: TRX1 (41 pins), TRX2 (41 pins)
VCC: TRX1 (8 pins), TRX2 (8 pins)